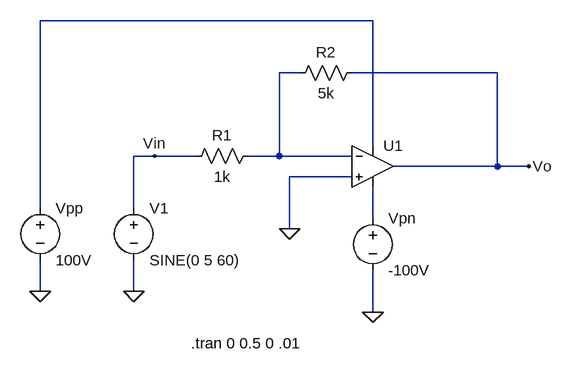
[diagram p0: schematic op_amp_intro.asc]
op_amp_intro.asc, the LTspice schematic file:
Version 4
SHEET 1 880 680
WIRE 240 -48 -272 -48
WIRE 128 32 96 32
WIRE 432 32 208 32
WIRE 240 144 240 -48
WIRE -96 160 -128 160
WIRE -32 160 -96 160
WIRE 96 160 96 32
WIRE 96 160 48 160
WIRE 208 160 96 160
WIRE 432 176 432 32
WIRE 432 176 272 176
WIRE 480 176 432 176
WIRE 208 192 112 192
WIRE -272 240 -272 -48
WIRE -128 240 -128 160
WIRE 240 256 240 208
WIRE 112 272 112 192
WIRE -272 368 -272 320
WIRE -128 368 -128 320
WIRE 240 400 240 336
FLAG -128 368 0
FLAG 112 272 0
FLAG 480 176 Vo
FLAG -96 160 Vin
FLAG -272 368 0
FLAG 240 400 0
SYMBOL Opamps\\UniversalOpamp2 240 176 R0
SYMATTR InstName U1
SYMBOL voltage -128 224 R0
WINDOW 123 0 0 Left 0
WINDOW 39 0 0 Left 0
SYMATTR InstName V1
SYMATTR Value SINE(0 5 60)
SYMBOL res 64 144 R90
WINDOW 0 0 56 VBottom 2
WINDOW 3 32 56 VTop 2
SYMATTR InstName R1
SYMATTR Value 1k
SYMBOL res 224 16 R90
WINDOW 0 0 56 VBottom 2
WINDOW 3 32 56 VTop 2
SYMATTR InstName R2
SYMATTR Value 5k
SYMBOL voltage -272 224 R0
WINDOW 123 0 0 Left 0
WINDOW 39 0 0 Left 0
SYMATTR InstName Vpp
SYMATTR Value 100V
SYMBOL voltage 240 240 R0
WINDOW 123 0 0 Left 0
WINDOW 39 0 0 Left 0
SYMATTR InstName Vpn
SYMATTR Value -100V
TEXT -40 448 Left 2 !.tran 0 0.5 0 .01

The netlist it stands for:
* op_amp_intro.asc
XU1 0 N002 N001 N003 Vo level.2 Avol=1Meg GBW=10Meg Slew=10Meg ilimit=25m rail=0 Vos=0 phimargin=45 en=0 enk=0 in=0 ink=0 Rin=500Meg  ; pins IN+ IN- V+ V- OUT
V1 Vin 0 SINE(0 5 60)
R1 N002 Vin 1k
R2 Vo N002 5k
Vpp N001 0 100V
Vpn N003 0 -100V
.tran 0 0.5 0 .01
.lib UniversalOpamps2.sub
.backanno
.end